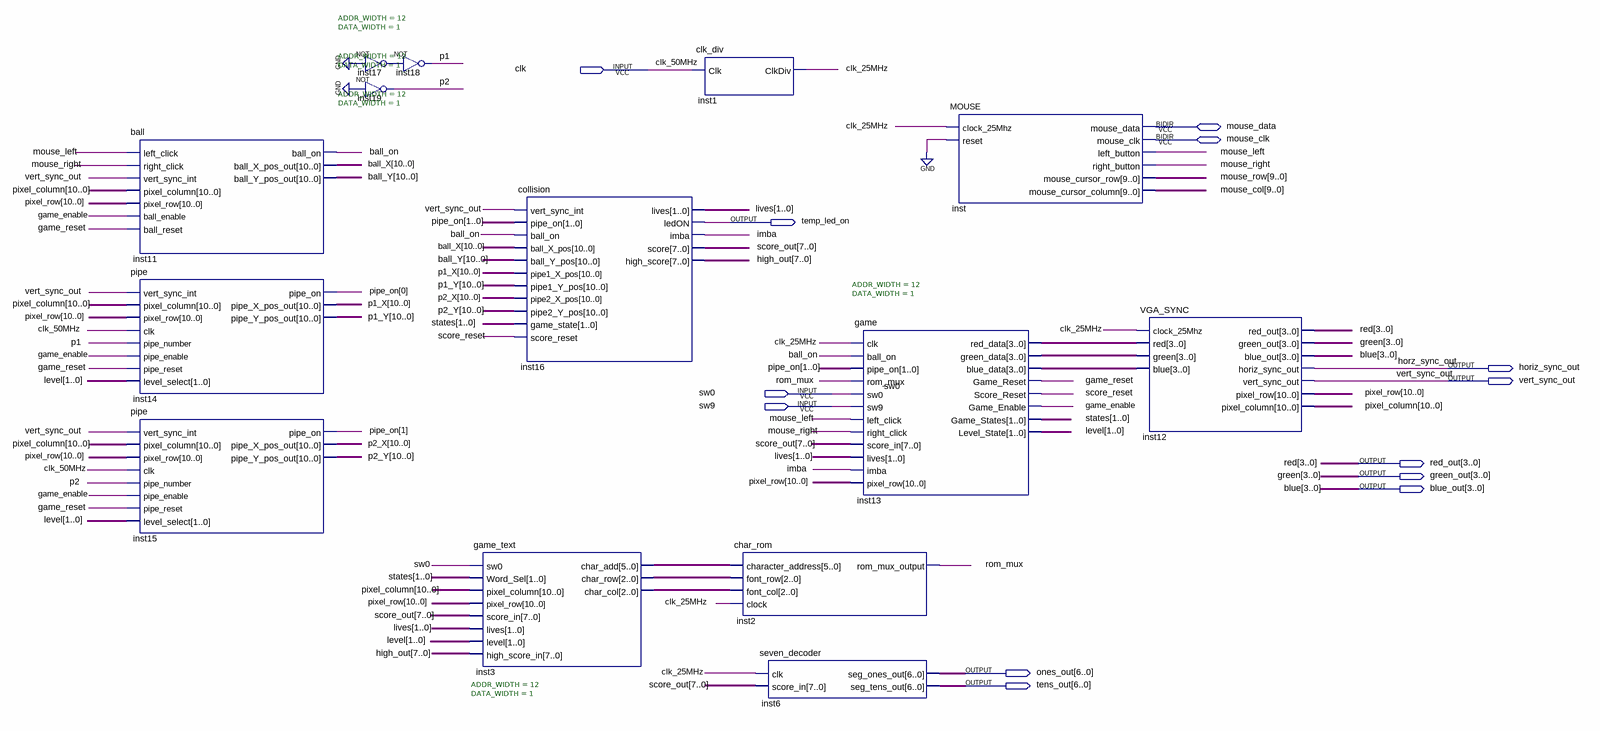
[diagram p0: schematic sheet]
// Quartus schematic Flashy_bird.bdf as structural Verilog: 14 symbols, 13 pins
module Flashy_bird (
  input  clk,
  input  sw0,
  input  sw9,
  inout  mouse_data,
  inout  mouse_clk,
  output temp_led_on,
  output horiz_sync_out,
  output vert_sync_out,
  output [3:0] red_out,
  output [3:0] green_out,
  output [3:0] blue_out,
  output [6:0] ones_out,
  output [6:0] tens_out
);

  wire ball_on, clk_25MHz, game_enable, game_reset, imba, inst17_out, mouse_left, mouse_right, p1, p2,
       rom_mux, score_reset;
  wire [1:0] level, lives, pipe_on, states;
  wire [2:0] inst3_char_col, inst3_char_row;
  wire [3:0] inst13_blue_data, inst13_green_data, inst13_red_data;
  wire [5:0] inst3_char_add;
  wire [7:0] high_out, score_out;
  wire [9:0] mouse_col, mouse_row;
  wire [10:0] ball_X, ball_Y, p1_X, p1_Y, p2_X, p2_Y, pixel_column, pixel_row;

  ball #(.ADDR_WIDTH(12), .DATA_WIDTH(1)) inst11 (
    .left_click(mouse_left), .right_click(mouse_right), .vert_sync_int(vert_sync_out),
    .pixel_column(pixel_column), .pixel_row(pixel_row), .ball_enable(game_enable), .ball_reset(game_reset),
    .ball_on(ball_on), .ball_X_pos_out(ball_X), .ball_Y_pos_out(ball_Y));
  pipe #(.ADDR_WIDTH(12), .DATA_WIDTH(1)) inst14 (
    .vert_sync_int(vert_sync_out), .pixel_column(pixel_column), .pixel_row(pixel_row), .clk(clk),
    .pipe_number(p1), .pipe_enable(game_enable), .pipe_reset(game_reset), .level_select(level),
    .pipe_on(pipe_on[0]), .pipe_X_pos_out(p1_X), .pipe_Y_pos_out(p1_Y));
  pipe #(.ADDR_WIDTH(12), .DATA_WIDTH(1)) inst15 (
    .vert_sync_int(vert_sync_out), .pixel_column(pixel_column), .pixel_row(pixel_row), .clk(clk),
    .pipe_number(p2), .pipe_enable(game_enable), .pipe_reset(game_reset), .level_select(level),
    .pipe_on(pipe_on[1]), .pipe_X_pos_out(p2_X), .pipe_Y_pos_out(p2_Y));
  not inst17 (inst17_out, 1'b0);
  not inst18 (p1, inst17_out);
  not inst19 (p2, 1'b0);
  game_text #(.ADDR_WIDTH(12), .DATA_WIDTH(1)) inst3 (
    .sw0(sw0), .Word_Sel(states), .pixel_column(pixel_column), .pixel_row(pixel_row), .score_in(score_out),
    .lives(lives), .level(level), .high_score_in(high_out), .char_add(inst3_char_add),
    .char_row(inst3_char_row), .char_col(inst3_char_col));
  collision inst16 (
    .vert_sync_int(vert_sync_out), .pipe_on(pipe_on), .ball_on(ball_on), .ball_X_pos(ball_X),
    .ball_Y_pos(ball_Y), .pipe1_X_pos(p1_X), .pipe1_Y_pos(p1_Y), .pipe2_X_pos(p2_X), .pipe2_Y_pos(p2_Y),
    .game_state(states), .score_reset(score_reset), .lives(lives), .ledON(temp_led_on), .imba(imba),
    .score(score_out), .high_score(high_out));
  clk_div inst1 (.Clk(clk), .ClkDiv(clk_25MHz));
  char_rom inst2 (
    .character_address(inst3_char_add), .font_row(inst3_char_row), .font_col(inst3_char_col),
    .clock(clk_25MHz), .rom_mux_output(rom_mux));
  seven_decoder inst6 (.clk(clk_25MHz), .score_in(score_out), .seg_ones_out(ones_out), .seg_tens_out(tens_out));
  game #(.ADDR_WIDTH(12), .DATA_WIDTH(1)) inst13 (
    .clk(clk_25MHz), .ball_on(ball_on), .pipe_on(pipe_on), .rom_mux(rom_mux), .sw0(sw0), .sw9(sw9),
    .left_click(mouse_left), .right_click(mouse_right), .score_in(score_out), .lives(lives), .imba(imba),
    .pixel_row(pixel_row), .red_data(inst13_red_data), .green_data(inst13_green_data),
    .blue_data(inst13_blue_data), .Game_Reset(game_reset), .Score_Reset(score_reset),
    .Game_Enable(game_enable), .Game_States(states), .Level_State(level));
  MOUSE inst (
    .clock_25Mhz(clk_25MHz), .reset(1'b0), .left_button(mouse_left), .right_button(mouse_right),
    .mouse_cursor_row(mouse_row), .mouse_cursor_column(mouse_col), .mouse_data(mouse_data),
    .mouse_clk(mouse_clk));
  VGA_SYNC inst12 (
    .clock_25Mhz(clk_25MHz), .red(inst13_red_data), .green(inst13_green_data), .blue(inst13_blue_data),
    .red_out(red_out), .green_out(green_out), .blue_out(blue_out), .horiz_sync_out(horiz_sync_out),
    .vert_sync_out(vert_sync_out), .pixel_row(pixel_row), .pixel_column(pixel_column));

  // Other names for the same wires on the sheet: blue[3:0] = blue_out; clk_50MHz = clk; green[3:0] = green_out;
  //   horz_sync_out = horiz_sync_out; red[3:0] = red_out
endmodule
